# EAGLE schematic Robot Arm 2_0 (EAGLE 6.3)
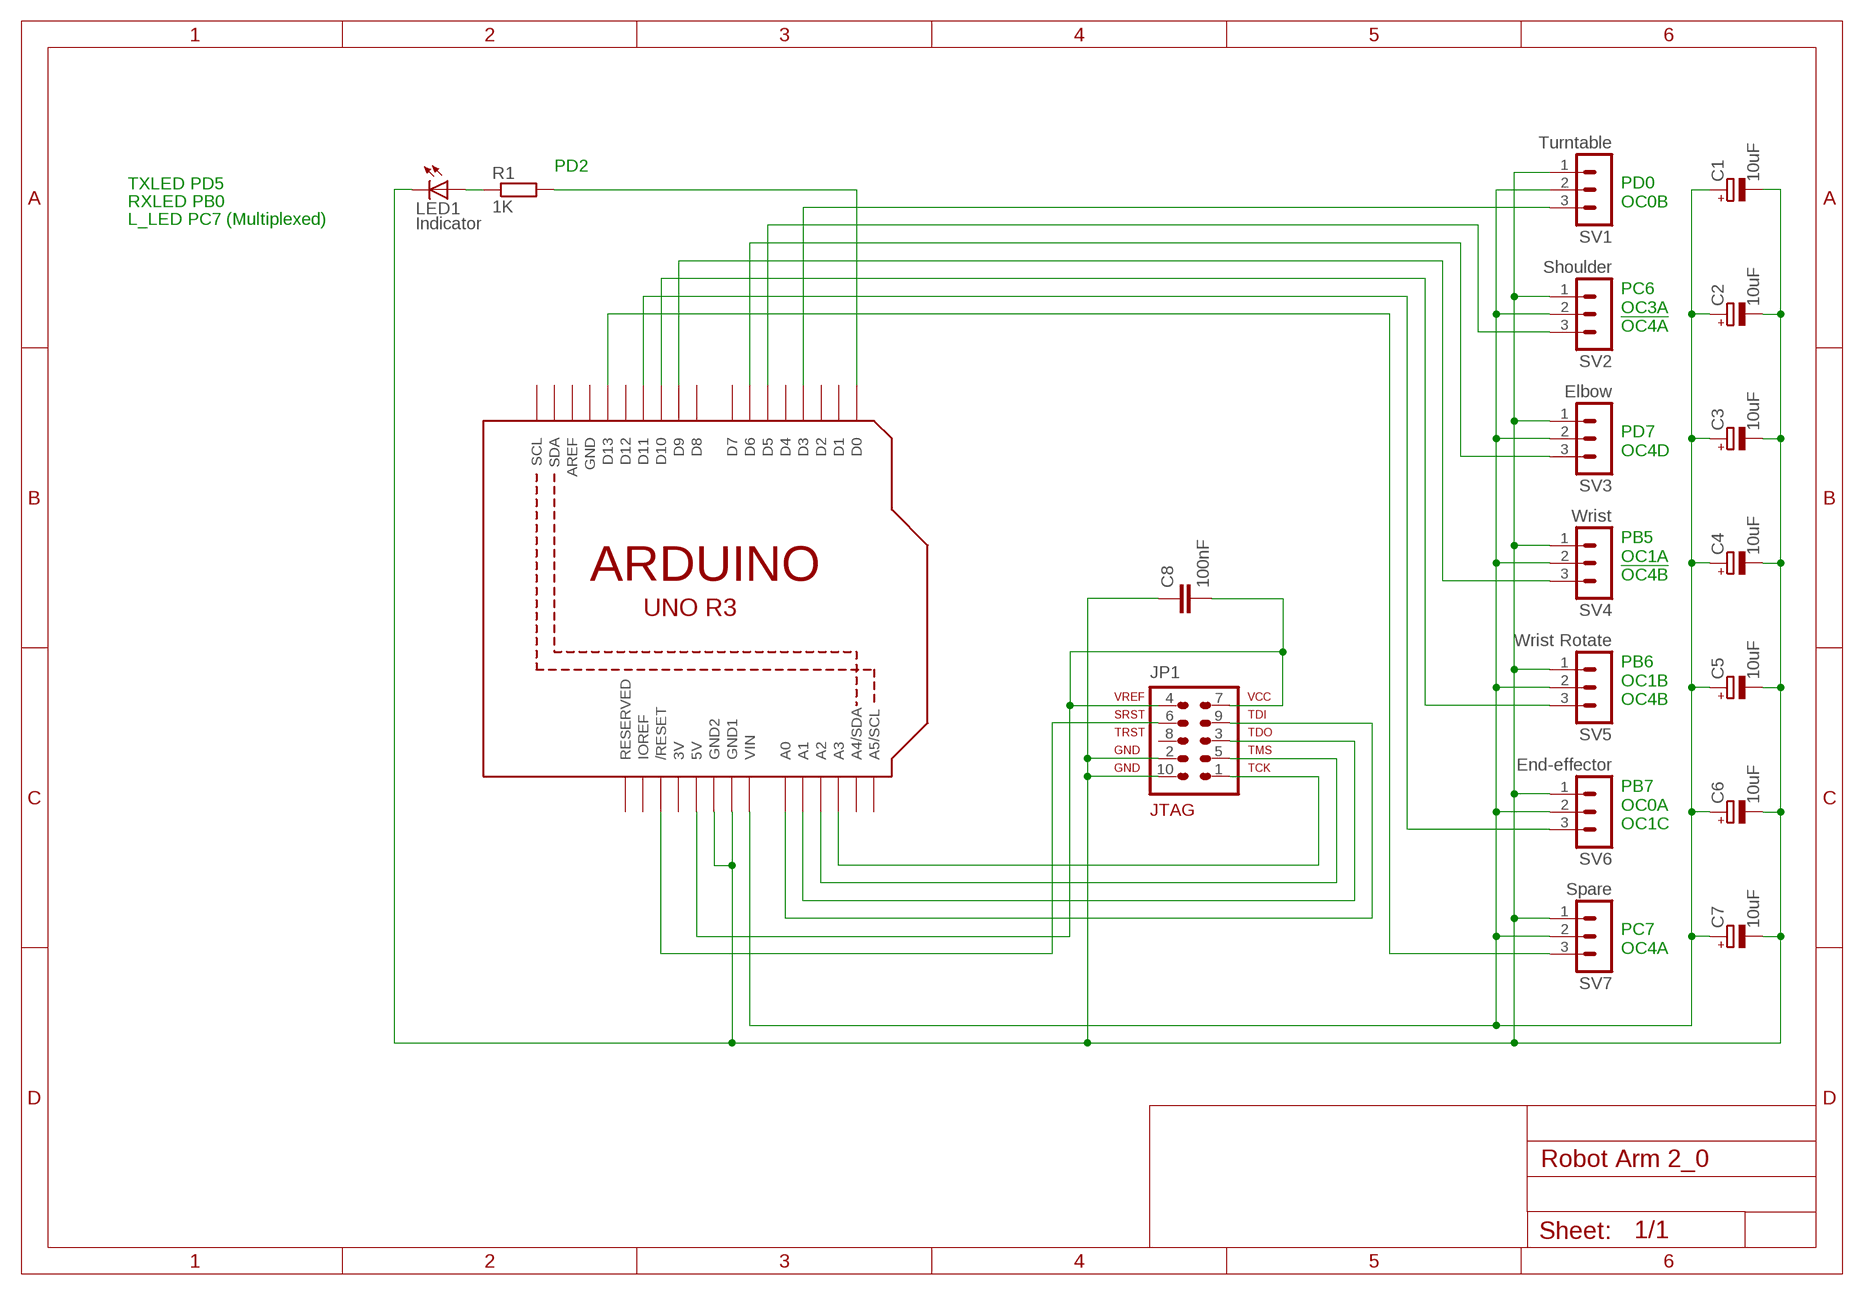
[diagram p0: schematic, sheet 1]

## Parts
C1  10uF  CPOL-EUE2.5-5  [E2,5-5]
C2  10uF  CPOL-EUE2.5-5  [E2,5-5]
C3  10uF  CPOL-EUE2.5-5  [E2,5-5]
C4  10uF  CPOL-EUE2.5-5  [E2,5-5]
C5  10uF  CPOL-EUE2.5-5  [E2,5-5]
C6  10uF  CPOL-EUE2.5-5  [E2,5-5]
C7  10uF  CPOL-EUE2.5-5  [E2,5-5]
C8  100nF  C-EU075-032X103  [C075-032X103]
JP1  AVR-JTAG-10  [AVR-JTAG-10]
LED1  Indicator  LED3MM  [LED3MM]
R1  1K  R-EU_0207/10  [0207/10]
SV1  Turntable  MA03-1  [MA03-1]
SV2  Shoulder  MA03-1  [MA03-1]
SV3  Elbow  MA03-1  [MA03-1]
SV4  Wrist  MA03-1  [MA03-1]
SV5  Wrist Rotate  MA03-1  [MA03-1]
SV6  End-effector  MA03-1  [MA03-1]
SV7  Spare  MA03-1  [MA03-1]
U1  ARDUINOR3-DIMENSION  [ARDUINOR3]

## Nets
N$1: C1.+ C2.+ C3.+ C4.+ C5.+ C6.+ C7.+ SV1.2 SV2.2 SV3.2 SV4.2 SV5.2 SV6.2 SV7.2 U1.VIN
N$2: C1.- C2.- C3.- C4.- C5.- C6.- C7.- C8.1 JP1.2 JP1.10 LED1.K(C) SV1.1 SV2.1 SV3.1 SV4.1 SV5.1 SV6.1 SV7.1 U1.GND1 U1.GND2
N$3: SV1.3 U1.D3
N$4: SV2.3 U1.D5
N$5: SV3.3 U1.D6
N$6: SV4.3 U1.D9
N$7: SV5.3 U1.D10
N$8: SV6.3 U1.D11
N$9: SV7.3 U1.D13
N$10: JP1.9 U1.A0
N$11: JP1.3 U1.A1
N$12: JP1.5 U1.A2
N$13: JP1.1 U1.A3
N$14: C8.2 JP1.4 JP1.7 U1.5V
N$15: JP1.6 U1.RESET(/RESET)
N$16: LED1.A R1.1
N$23: R1.2 U1.D0
Unconnected: JP1.8 U1.A4(A4/SDA) U1.A5(A5/SCL) U1.AREF U1.D1 U1.D2 U1.D4 U1.D7 U1.D8 U1.D12 U1.IOREF U1.RESERVED U1.SCL U1.SDA

## Notes on the sheet
- PD2
- TXLED PD5
- RXLED PB0
- PD0
  OC0B
- L_LED PC7 (Multiplexed)
- PC6
  OC3A
  !OC4A
- PD7
  OC4D
- PB5
  OC1A
  !OC4B
- PB6
  OC1B
  OC4B
- PB7
  OC0A
  OC1C
- PC7
  OC4A

## Power pins joined to a net without a drawn wire
3V: U1.3V
GND: U1.GND

## Library data of the parts
C1-C7 = rcl:CPOL-EU: POLARIZED CAPACITOR, European symbol
C8 = rcl:C-EU: CAPACITOR, European symbol
JP1 = avr-4:AVR-JTAG-10: AVR JTAG Debug/Programming Header
LED1 = led:LED: LED OSRAM: - CHIPLED LG R971, LG N971, LY N971, LG Q971, LY Q971, LO R971, LY R971 LH N974, LH R974 LS Q976, LO Q976, LY Q976 LO Q996 - Hyper CHIPLED LW Q18S LB Q993, LB Q99A, LB R99A - SideLED LS A670, LO A670, LY A670, LG A670, LP A670 LB A673, LV A673, LT A673, LW A673 LH A674 LY A675 LS A676, LA A676, LO A676, LY A676, LW A676 LS A679, LY A679, LG A679 - Hyper Micro SIDELED® LS Y876, LA Y876, LO Y876, LY Y876 LT Y87S - SmartLED LW L88C, LW L88S LB L89C, LB L89S, LG L890 LS L89K, LO L89K, LY L89K LS L896, LA L896, LO L896, LY L896 - TOPLED LS T670, LO T670, LY T670, LG T670, LP T670 LSG T670, LSP T670, LSY T670, LOP T670, LYG T670 LG T671, LOG T671, LSG T671 LB T673, LV T673, LT T673, LW T673 LH T674 LS T676, LA T676, LO T676, LY T676, LB T676, LH T676, LSB T676, LW T676 LB T67C, LV T67C, LT T67C, LS T67K, LO T67K, LY T67K, LW E67C LS E67B, LA E67B, LO E67B, LY E67B, LB E67C, LV E67C, LT E67C LW T67C LS T679, LY T679, LG T679 LS T770, LO T770, LY T770, LG T770, LP T770 LB T773, LV T773, LT T773, LW T773 LH T774 LS E675, LA E675, LY E675, LS T675 LS T776, LA T776, LO T776, LY T776, LB T776 LHGB T686 LT T68C, LB T68C - Hyper Mini TOPLED® LB M676 - Mini TOPLED Santana® LG M470 LS M47K, LO M47K, LY M47K Source: http://www.osram.convergy.de LUXEON: - LUMILED® LXK2-PW12-R00, LXK2-PW12-S00, LXK2-PW14-U00, LXK2-PW14-V00 LXK2-PM12-R00, LXK2-PM12-S00, LXK2-PM14-U00 LXK2-PE12-Q00, LXK2-PE12-R00, LXK2-PE12-S00, LXK2-PE14-T00, LXK2-PE14-U00 LXK2-PB12-K00, LXK2-PB12-L00, LXK2-PB12-M00, LXK2-PB14-N00, LXK2-PB14-P00, LXK2-PB14-Q00 LXK2-PR12-L00, LXK2-PR12-M00, LXK2-PR14-Q00, LXK2-PR14-R00 LXK2-PD12-Q00, LXK2-PD12-R00, LXK2-PD12-S00 LXK2-PH12-R00, LXK2-PH12-S00 LXK2-PL12-P00, LXK2-PL12-Q00, LXK2-PL12-R00 Source: www.luxeon.com KINGBRIGHT: KA-3528ASYC Source: www.kingbright.com
R1 = resistor:R-EU_: RESISTOR, European symbol
SV1-SV7 = con-lstb:MA03-1: PIN HEADER; OC_FARNELL: unknown; OC_NEWARK: unknown
U1 = adafruit:ARDUINOR3: This is a new object for the new Arduino R3 - with extra pins that you may want to use (such as IOref, and duplicated A4/A5